# EasyEDA schematic 1-Schematic_paystsn.json
TITLE: prototype3; REV: 3; Date: 2021/22/1; Sheet: 1/1; Drawn By: Gergely Szabó; Company: Student at BME VIK
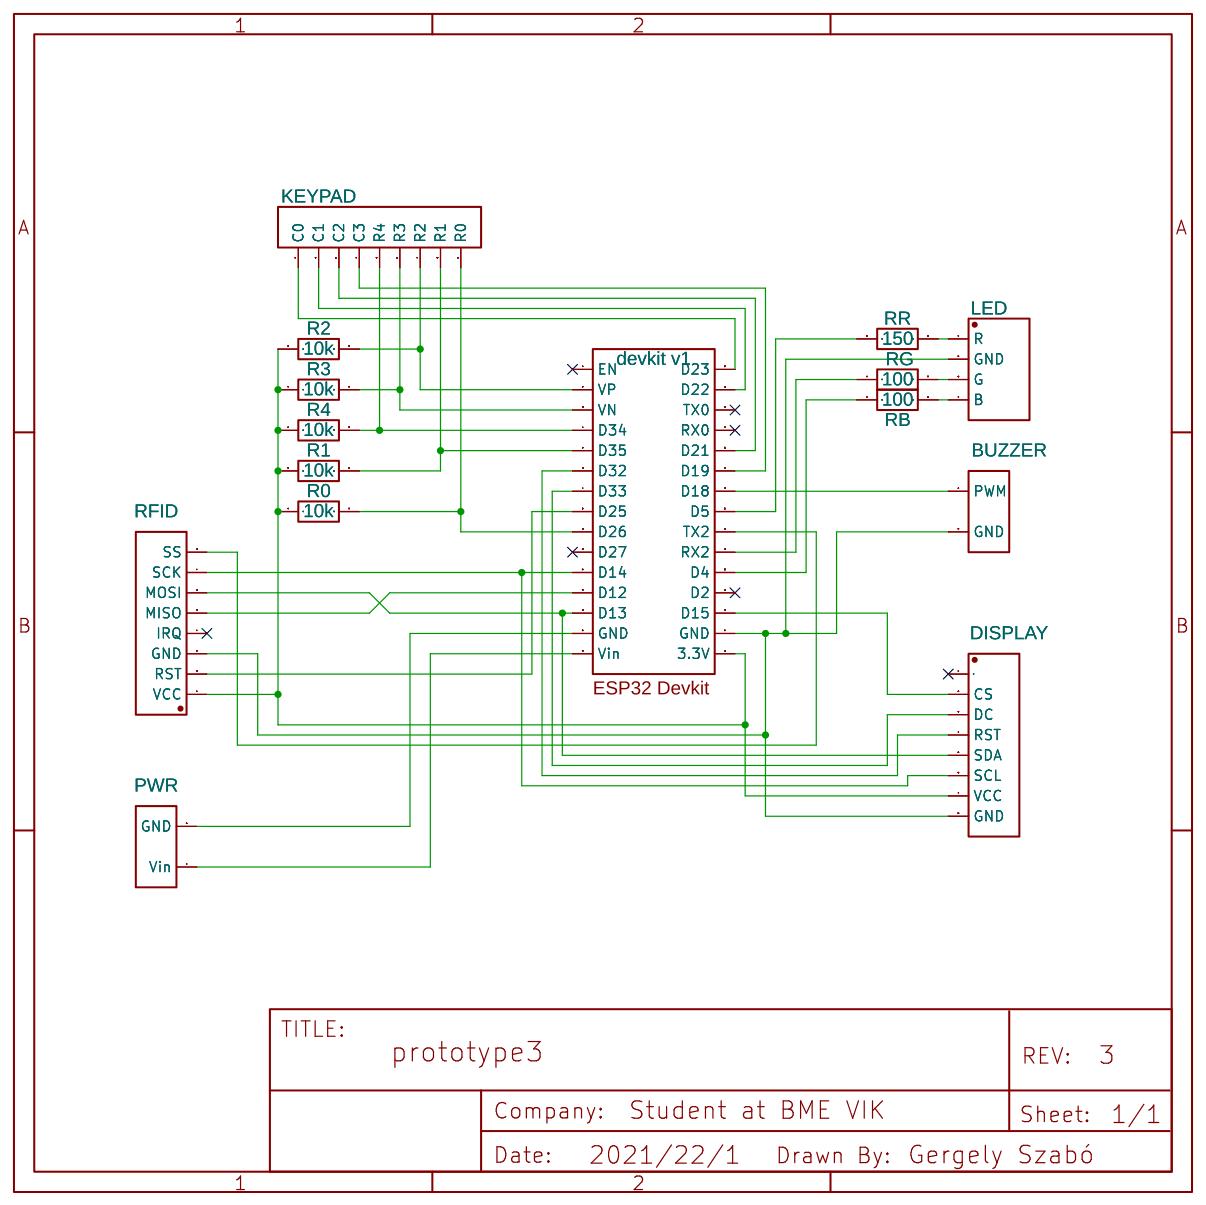
[diagram p0: schematic sheet]

## Parts
BUZZER  Buzzer  [HDR-TH_2P-P2.54-V]
DISPLAY  Display  [HDR-TH_8P-P2.54-V-M]
ESP32  devkit v1  [ESP32_DEVKIT_V1]
KEYPAD  Keypad  [HDR-TH_9P-P2.54-V]
LED  LED  [HDR-TH_4P-P2.54-V]
PWR  Power  [HDR-TH_2P-P2.54-V]
R0  10k  [R0603]
R1  10k  [R0603]
R2  10k  [R0603]
R3  10k  [R0603]
R4  10k  [R0603]
RB  100  [R0603]
RFID  RFID  [HDR-TH_8P-P2.54-V-M]
RG  100  [R0603]
RR  150  [R0603]

## Library data of the parts
BUZZER PWR = Header-Male-2.54_1x2: Supplier: LCSC; Manufacturer: TE Connectivity; Manufacturer Part: 826629-2; image: //image.lceda.cn/szlcsc/C86471.jpg; Supplier Part: C86471
DISPLAY RFID = Header-Male-2.54_1x8: Supplier: LCSC; Manufacturer: Ckmtw; Manufacturer Part: 210S-1*8P L=11.6MMGold-plated black; Contributor: LCSC; Supplier Part: C124381
ESP32 = esp32: Contributor: CDEI-UPC
KEYPAD = Header-Female-2.54_1x9: Supplier: LCSC; Manufacturer: BOOMELE; Manufacturer Part: 2.54mm 1*9 Straight Female header; image: //image.lceda.cn/szlcsc/C39576.jpg; Supplier Part: C39576
LED = Header-Male-2.54_1x4: Supplier: LCSC; Manufacturer: Ckmtw; Manufacturer Part: 210S-1*4P L=11.6MMGold-plated black; Contributor: LCSC; Supplier Part: C124378
R0-R4 RB RG RR = R_0603_EU: Contributor: LCEDA_Lib

## Nets
Net-(BUZZER-1): BUZZER.1(PWM) ESP32.24(D18)
Net-(BUZZER-2): BUZZER.2(GND) DISPLAY.8(GND) ESP32.17(GND) LED.2(GND) RFID.3(GND)
Net-(DISPLAY-2): DISPLAY.2(CS) ESP32.18(D15)
Net-(DISPLAY-3): DISPLAY.3(DC) ESP32.7(D33)
Net-(DISPLAY-4): DISPLAY.4(RST) ESP32.6(D32)
Net-(DISPLAY-5): DISPLAY.5(SDA) ESP32.13(D13) RFID.6(MOSI)
Net-(DISPLAY-6): DISPLAY.6(SCL) ESP32.11(D14) RFID.7(SCK)
Net-(DISPLAY-7): DISPLAY.7(VCC) ESP32.16(3.3V) R0.1 R1.1 R2.1 R3.1 R4.1 RFID.1(VCC)
Net-(ESP32-2): ESP32.2(VP) KEYPAD.7(R2) R2.2
Net-(ESP32-3): ESP32.3(VN) KEYPAD.6(R3) R3.2
Net-(ESP32-4): ESP32.4(D34) KEYPAD.5(R4) R4.2
Net-(ESP32-5): ESP32.5(D35) KEYPAD.8(R1) R1.2
Net-(ESP32-8): ESP32.8(D25) RFID.2(RST)
Net-(ESP32-9): ESP32.9(D26) KEYPAD.9(R0) R0.2
Net-(ESP32-12): ESP32.12(D12) RFID.5(MISO)
Net-(ESP32-14): ESP32.14(GND) PWR.2(GND)
Net-(ESP32-15): ESP32.15(Vin) PWR.1(Vin)
Net-(ESP32-20): ESP32.20(D4) RB.1
Net-(ESP32-21): ESP32.21(RX2) RG.1
Net-(ESP32-22): ESP32.22(TX2) RFID.8(SS)
Net-(ESP32-23): ESP32.23(D5) RR.1
Net-(ESP32-25): ESP32.25(D19) KEYPAD.4(C3)
Net-(ESP32-26): ESP32.26(D21) KEYPAD.3(C2)
Net-(ESP32-29): ESP32.29(D22) KEYPAD.2(C1)
Net-(ESP32-30): ESP32.30(D23) KEYPAD.1(C0)
Net-(LED-1): LED.1(R) RR.2
Net-(LED-3): LED.3(G) RG.2
Net-(LED-4): LED.4(B) RB.2

Not connected (* = marked no-connect by the designer): DISPLAY 1*; ESP32 1(EN)* 10(D27)* 19(D2)* 27(RX0)* 28(TX0)*; RFID 4(IRQ)*
